# EAGLE design جمعة جمعة وجمعة قصب وعبد المجيد حريري (EAGLE 6.4)
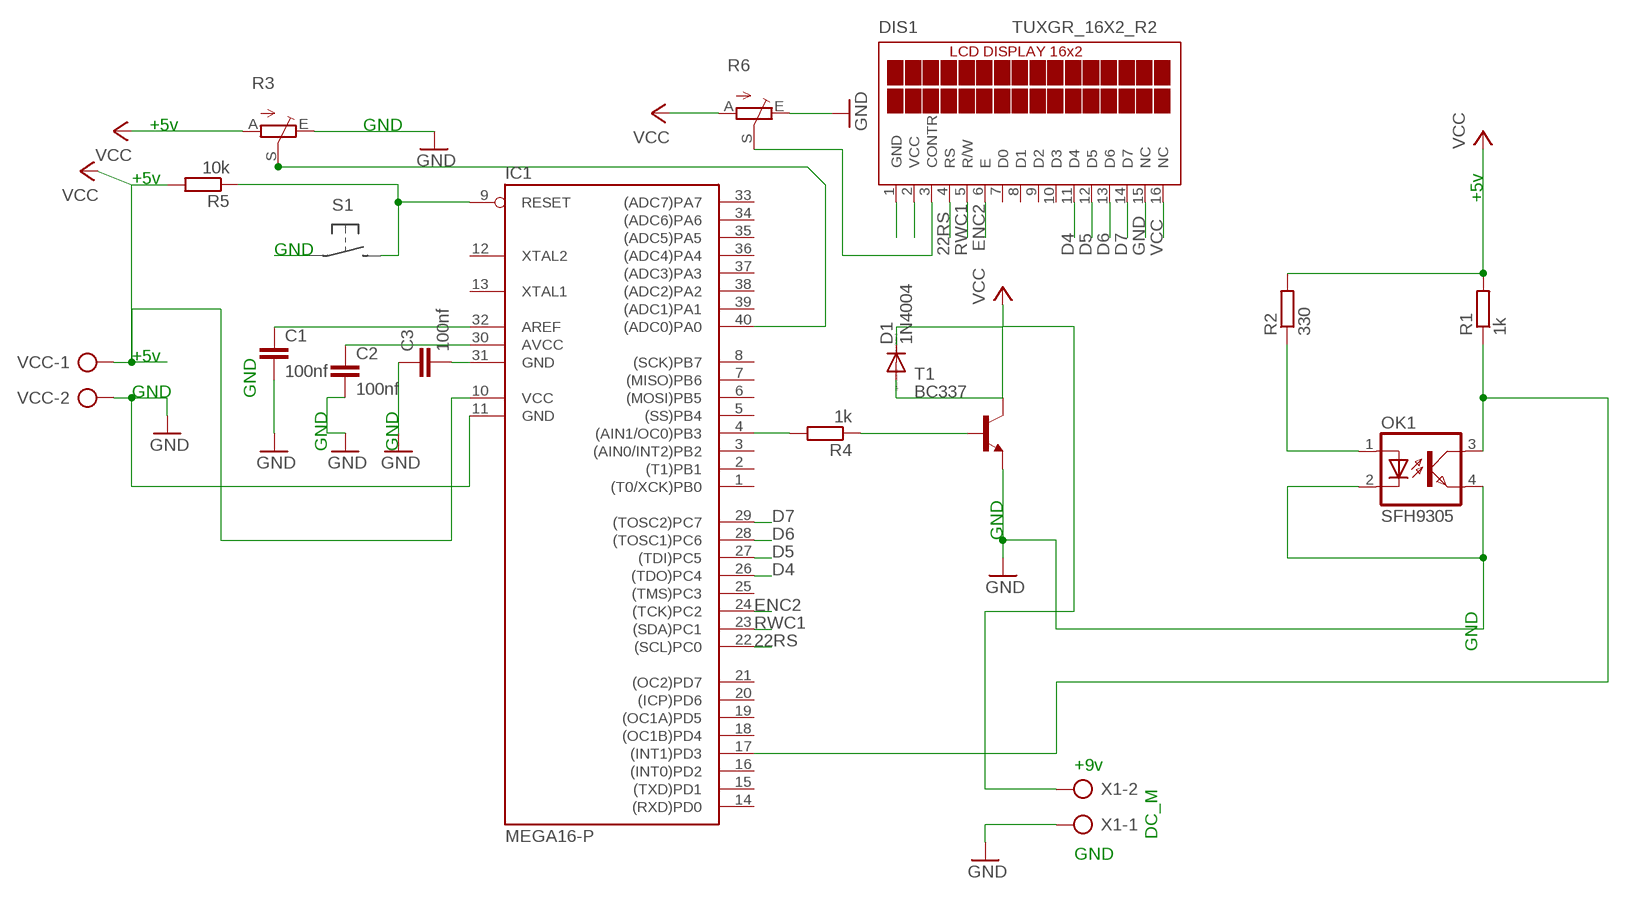
[diagram p0: schematic, sheet 1]

## Parts
C1  100nf  C2,5-3  [C2.5-3]
C2  100nf  C2,5-3  [C2.5-3]
C3  100nf  C2,5-3  [C2.5-3]
D1  1N4004  [DO41-10]
DIS1  TUXGR_16X2_R2  [TUXGR_16X2_R2]
IC1  MEGA16-P  [DIL40]
OK1  SFH9305  [SFH9305]
R1  1k  R-EU_0204/7  [0204/7]
R2  330  R-EU_0204/7  [0204/7]
R3  TRIM_EU-CA9V  [CA9V]
R4  1k  R-EU_0204/7  [0204/7]
R5  10k  R-EU_0204/7  [0204/7]
R6  TRIM_EU-CA9V  [CA9V]
T1  BC337  [TO92]
VCC  AK300/2  [AK300/2]
X1  AK300/2  [AK300/2]

## Nets
22RS: DIS1.4(RS) IC1.22((SCL)PC0)
D4: DIS1.11(D4) IC1.26((TDO)PC4)
D5: DIS1.12(D5) IC1.27((TDI)PC5)
D6: DIS1.13(D6) IC1.28((TOSC1)PC6)
D7: DIS1.14(D7) IC1.29((TOSC2)PC7)
ENC2: DIS1.6(E) IC1.24((TCK)PC2)
GND: C1.2 C2.2 C3.1 DIS1.15(NC) IC1.11(GND) OK1.2(C) OK1.4(EMIT) R3.E R6.E T1.1(E) VCC.2 X1.1
N$1: OK1.1(A) R2.1
N$2: IC1.17((INT1)PD3) OK1.3(COL) R1.1
N$3: IC1.9(RESET) R5.1
N$4: C1.1 IC1.32(AREF)
N$5: R4.1 T1.2(B)
N$6: IC1.4((AIN1/OC0)PB3) R4.2
N$7: C2.1 IC1.30(AVCC)
N$9: C3.2 IC1.31(GND)
N$12: IC1.40((ADC0)PA0) R3.S
N$22: DIS1.1(GND)
N$23: DIS1.2(VCC)
N$24: DIS1.3(CONTR) R6.S
N$28: D1.A T1.3(C)
RWC1: DIS1.5(R/W) IC1.23((SDA)PC1)
VCC: D1.C DIS1.16(NC) IC1.10(VCC) R1.2 R2.2 R3.A R5.2 R6.A VCC.1 X1.2
Unconnected: DIS1.7(D0) DIS1.8(D1) DIS1.9(D2) DIS1.10(D3) IC1.1((T0/XCK)PB0) IC1.2((T1)PB1) IC1.3((AIN0/INT2)PB2) IC1.5((SS)PB4) IC1.6((MOSI)PB5) IC1.7((MISO)PB6) IC1.8((SCK)PB7) IC1.12(XTAL2) IC1.13(XTAL1) IC1.14((RXD)PD0) IC1.15((TXD)PD1) IC1.16((INT0)PD2) IC1.18((OC1B)PD4) IC1.19((OC1A)PD5) IC1.20((ICP)PD6) IC1.21((OC2)PD7) IC1.25((TMS)PC3) IC1.33((ADC7)PA7) IC1.34((ADC6)PA6) IC1.35((ADC5)PA5) IC1.36((ADC4)PA4) IC1.37((ADC3)PA3) IC1.38((ADC2)PA2) IC1.39((ADC1)PA1)

## Notes on the sheet
- +5v | GND
- +5v
- +5v
- GND
- +5v
- GND | GND
- GND | GND
- GND
- GND
- +9v
- DC_M
- GND

## Library data of the parts
C1-C3 = capacitor-wima:C: CAPACITOR naming: grid - package width
D1 = diode:1N4004: DIODE general purpose rectifier, 1 A
DIS1 = display-lcd:TUXGR_16X2_R2: Tuxgraphics LCD display 16x2 characters reflective, without background light Source: tuxgr_12x2_r2.pdf; OC_FARNELL: unknown; OC_NEWARK: unknown
IC1 = atmel:MEGA16-P: MICROCONTROLLER 16 Kbytes FLASH 1 kbytes SRAM 512 bytes EEPROM USART 8-channel 10 bit ADC Source: avr.lbr; MPN: ATMEGA16-16PU; OC_FARNELL: 9171142; OC_NEWARK: 01M6885
OK1 = optocoupler:SFH9*: Slotted Interrupter / Gabellichtschranke Source: http://www.osram.convergy.de/; OC_FARNELL: unknown; OC_NEWARK: unknown
R1 R2 R4 R5 = resistor:R-EU_: RESISTOR, European symbol
R3 R6 = pot:TRIM_EU-: POTENTIOMETER
T1 = transistor:BC337: NPN TRANSISTOR
VCC X1 = con-ptr500:AK300/2: CONNECTOR; OC_FARNELL: unknown; OC_NEWARK: unknown

## Board
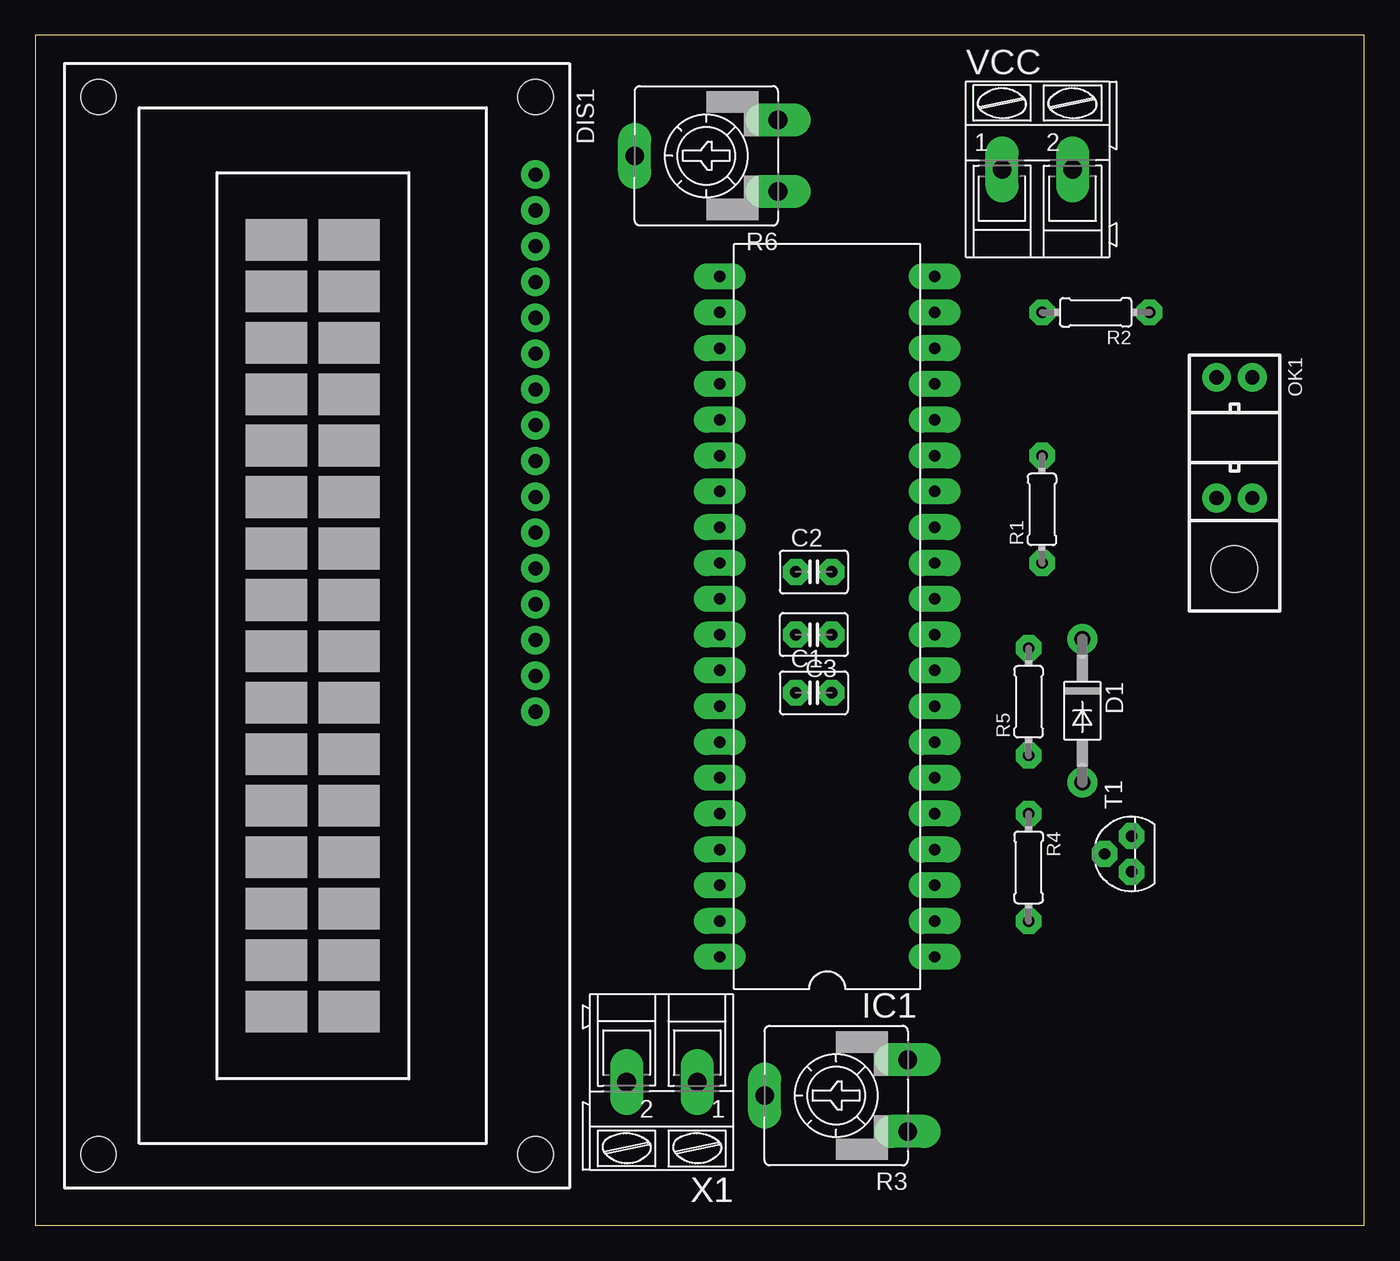
[diagram p1: board, top side]
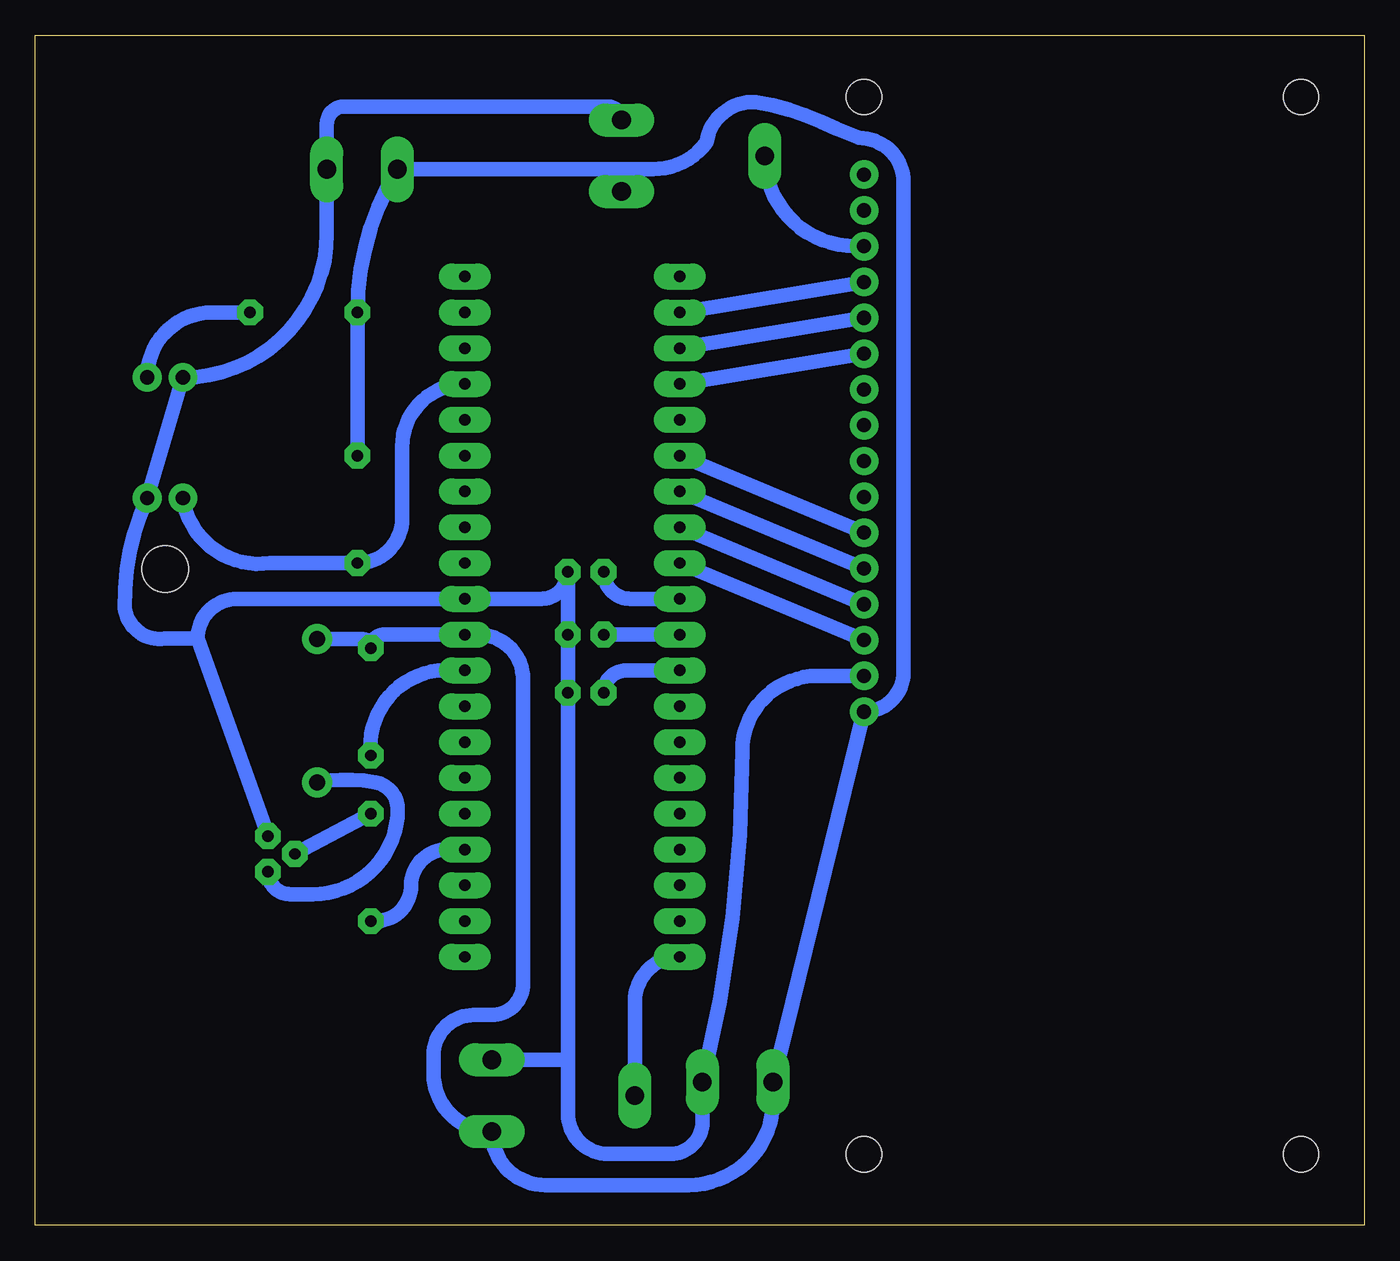
[diagram p2: board, bottom side, seen from below]

Size 94.28 x 84.44 mm. Coordinates in mm from the lower left corner, seen from the top.
Outline: 94.28,0 94.28,84.44 0,84.44 0,0 94.28,0
Copper layers (1*16): Top 0.035mm / dielectric 1.5mm / Bottom 0.035mm
Design rules "default *": minimum track width 10mil, minimum drill 25mil, track to track 8mil, track to pad 8mil, pad to pad 8mil, via to via 8mil, smd to smd 8mil, copper to edge 40mil, drill to drill 8mil, minimum pad ring 25mil, minimum via ring 8mil, stop-mask expansion 4mil, vias tented up to drill 0mil, thermal gap 10mil

### Footprints (pad centres in the part's own frame; a part is rotated, then mirrored left to right if it is on the bottom)
C2.5-3 = drill 0.813 pad 1.6 octagon: 1 -1.27,0; 2 1.27,0
DO41-10 = drill 1.118: A 5.08,0; C -5.08,0
TUXGR_16X2_R2 = drill 1 pad 1.676: 1 -32,15.5; 2 -29.46,15.5; 3 -26.92,15.5; 4 -24.38,15.5; 5 -21.84,15.5; 6 -19.3,15.5; 7 -16.76,15.5; 8 -14.22,15.5; 9 -11.68,15.5; 10 -9.14,15.5; 11 -6.6,15.5; 12 -4.06,15.5; 13 -1.52,15.5; 14 1.02,15.5; 15 3.56,15.5; 16 6.1,15.5 | hole 2.5: -37.5,-15.5; 37.5,-15.5; -37.5,15.5; 37.5,15.5
DIL40 = drill 0.813 long: 1 -24.13,-7.62; 2 -21.59,-7.62; 3 -19.05,-7.62; 4 -16.51,-7.62; 5 -13.97,-7.62; 6 -11.43,-7.62; 7 -8.89,-7.62; 8 -6.35,-7.62; 9 -3.81,-7.62; 10 -1.27,-7.62; 11 1.27,-7.62; 12 3.81,-7.62; 13 6.35,-7.62; 14 8.89,-7.62; 15 11.43,-7.62; 16 13.97,-7.62; 17 16.51,-7.62; 18 19.05,-7.62; 19 21.59,-7.62; 20 24.13,-7.62; 21 24.13,7.62; 22 21.59,7.62; 23 19.05,7.62; 24 16.51,7.62; 25 13.97,7.62; 26 11.43,7.62; 27 8.89,7.62; 28 6.35,7.62; 29 3.81,7.62; 30 1.27,7.62; 31 -1.27,7.62; 32 -3.81,7.62; 33 -6.35,7.62; 34 -8.89,7.62; 35 -11.43,7.62; 36 -13.97,7.62; 37 -16.51,7.62; 38 -19.05,7.62; 39 -21.59,7.62; 40 -24.13,7.62
SFH9305 = drill 1.016: 1 -4.275,1.27; 2 -4.275,-1.27; 3 4.275,-1.27; 4 4.275,1.27 | hole 3.3: 9.3,0
0204/7 = drill 0.813 octagon: 1 -3.81,0; 2 3.81,0
CA9V = drill 1.321 long: A -2.54,-5.08; E 2.54,-5.08; S 0,5.08
TO92 = drill 0.813 octagon: 1 1.27,0; 2 0,1.905; 3 -1.27,0
AK300/2 = drill 1.321 long: 1 -2.515,0; 2 2.489,0

### Placement (x,y rotation side)
C1  55.23,37.78 0 top
C2  55.23,46.35 0 top
C3  55.23,41.91 180 top
D1  74.28,36.51 270 top
DIS1  19.99,42.55 270 top
IC1  56.18,43.18 90 top
OK1  85.08,55.88 270 top
R1  71.42,50.8 90 top
R2  75.23,64.77 180 top
R3  56.82,9.21 90 top
R4  70.47,25.4 270 top
R5  70.47,37.15 90 top
R6  47.61,75.88 90 top
T1  77.77,26.35 90 top
VCC  71.11,74.93 0 top
X1  44.44,10.16 180 top

### Tracks (layer width: path | path; a pad name or v marks a point on that pad's centre or on a via)
22RS
  Bottom 1.016: DIS1.4 IC1.22
D4
  Bottom 1.016: DIS1.11 IC1.26
D5
  Bottom 1.016: DIS1.12 IC1.27
D6
  Bottom 1.016: IC1.28 DIS1.13
D7
  Bottom 1.016: DIS1.14 IC1.29
ENC2
  Bottom 1.016: DIS1.6 IC1.24
GND
  Bottom 1.016: 56.5,11.43 56.5,7.94 arc-90 53.64,5.08 49.2,5.08 arc-90 46.95,7.33 X1.1 arc-14 44.12,33.66 arc90 38.79,38.98 DIS1.15 | 56.5,11.43 C1.2 C3.1 C2.2 arc90 58.41,44.45 IC1.11 79.95,44.45 arc-90 82.78,41.62 | R3.E 56.82,11.75 arc90 56.5,11.43 | T1.1 82.78,41.62 | R6.E arc-90 53.64,79.38 72.38,79.38 arc-90 73.6,78.16 VCC.2 73.6,70.37 arc90 OK1.2 OK1.4 arc-25 87.94,43.81 arc-90 85.1,41.62 82.78,41.62
N$1
  Bottom 1.016: R2.1 81.73,64.77 arc-90 OK1.1
N$2
  Bottom 1.016: IC1.17 arc-90 68.25,55.24 68.25,50.16 arc90 R1.1 77.61,46.99 arc90 OK1.3
N$3
  Bottom 1.016: IC1.9 65.71,39.37 arc-90 R5.1
N$4
  Bottom 1.016: IC1.32 52.38,39.37 arc-90 C1.1
N$5
  Bottom 1.016: T1.2 R4.1
N$6
  Bottom 1.016: IC1.4 65.08,26.67 arc-90 67.61,24.13 arc97 R4.2
N$7
  Bottom 1.016: IC1.30 52.06,44.45 arc90 C2.1
N$9
  Bottom 1.016: C3.2 IC1.31
N$12
  Bottom 1.016: R3.S 51.74,15.88 arc90 IC1.40
N$24
  Bottom 1.016: DIS1.3 36.11,69.47 arc90 R6.S
N$28
  Bottom 1.016: T1.3 arc-90 76.19,23.5 74.6,23.5 arc-90 68.57,29.53 arc-80 70.16,31.43 arc-21 D1.A
RWC1
  Bottom 1.016: DIS1.5 IC1.23
VCC
  Bottom 1.016: D1.C 71.11,41.59 arc90 R5.2 arc90 69.52,41.91 IC1.10 62.85,41.91 arc90 59.68,38.73 59.68,17.14 arc90 61.9,14.92 63.17,14.92 arc-90 66.03,12.06 66.03,10.79 arc-90 R3.A arc-90 58.09,2.86 47.93,2.86 arc-90 41.95,8.84 X1.2 DIS1.16 arc-90 32.69,39.24 32.69,74.3 arc-85 35.86,77.15 37.45,77.79 arc-19 43.17,79.69 arc-85 46.66,76.83 arc53 50.47,74.93 54.28,74.93 | R6.A arc-90 54.28,74.93 | 54.28,74.93 VCC.1 arc-31 R2.2 R1.2